# EAGLE design Robot Brushless Driver v4.3 (EAGLE 4.16)
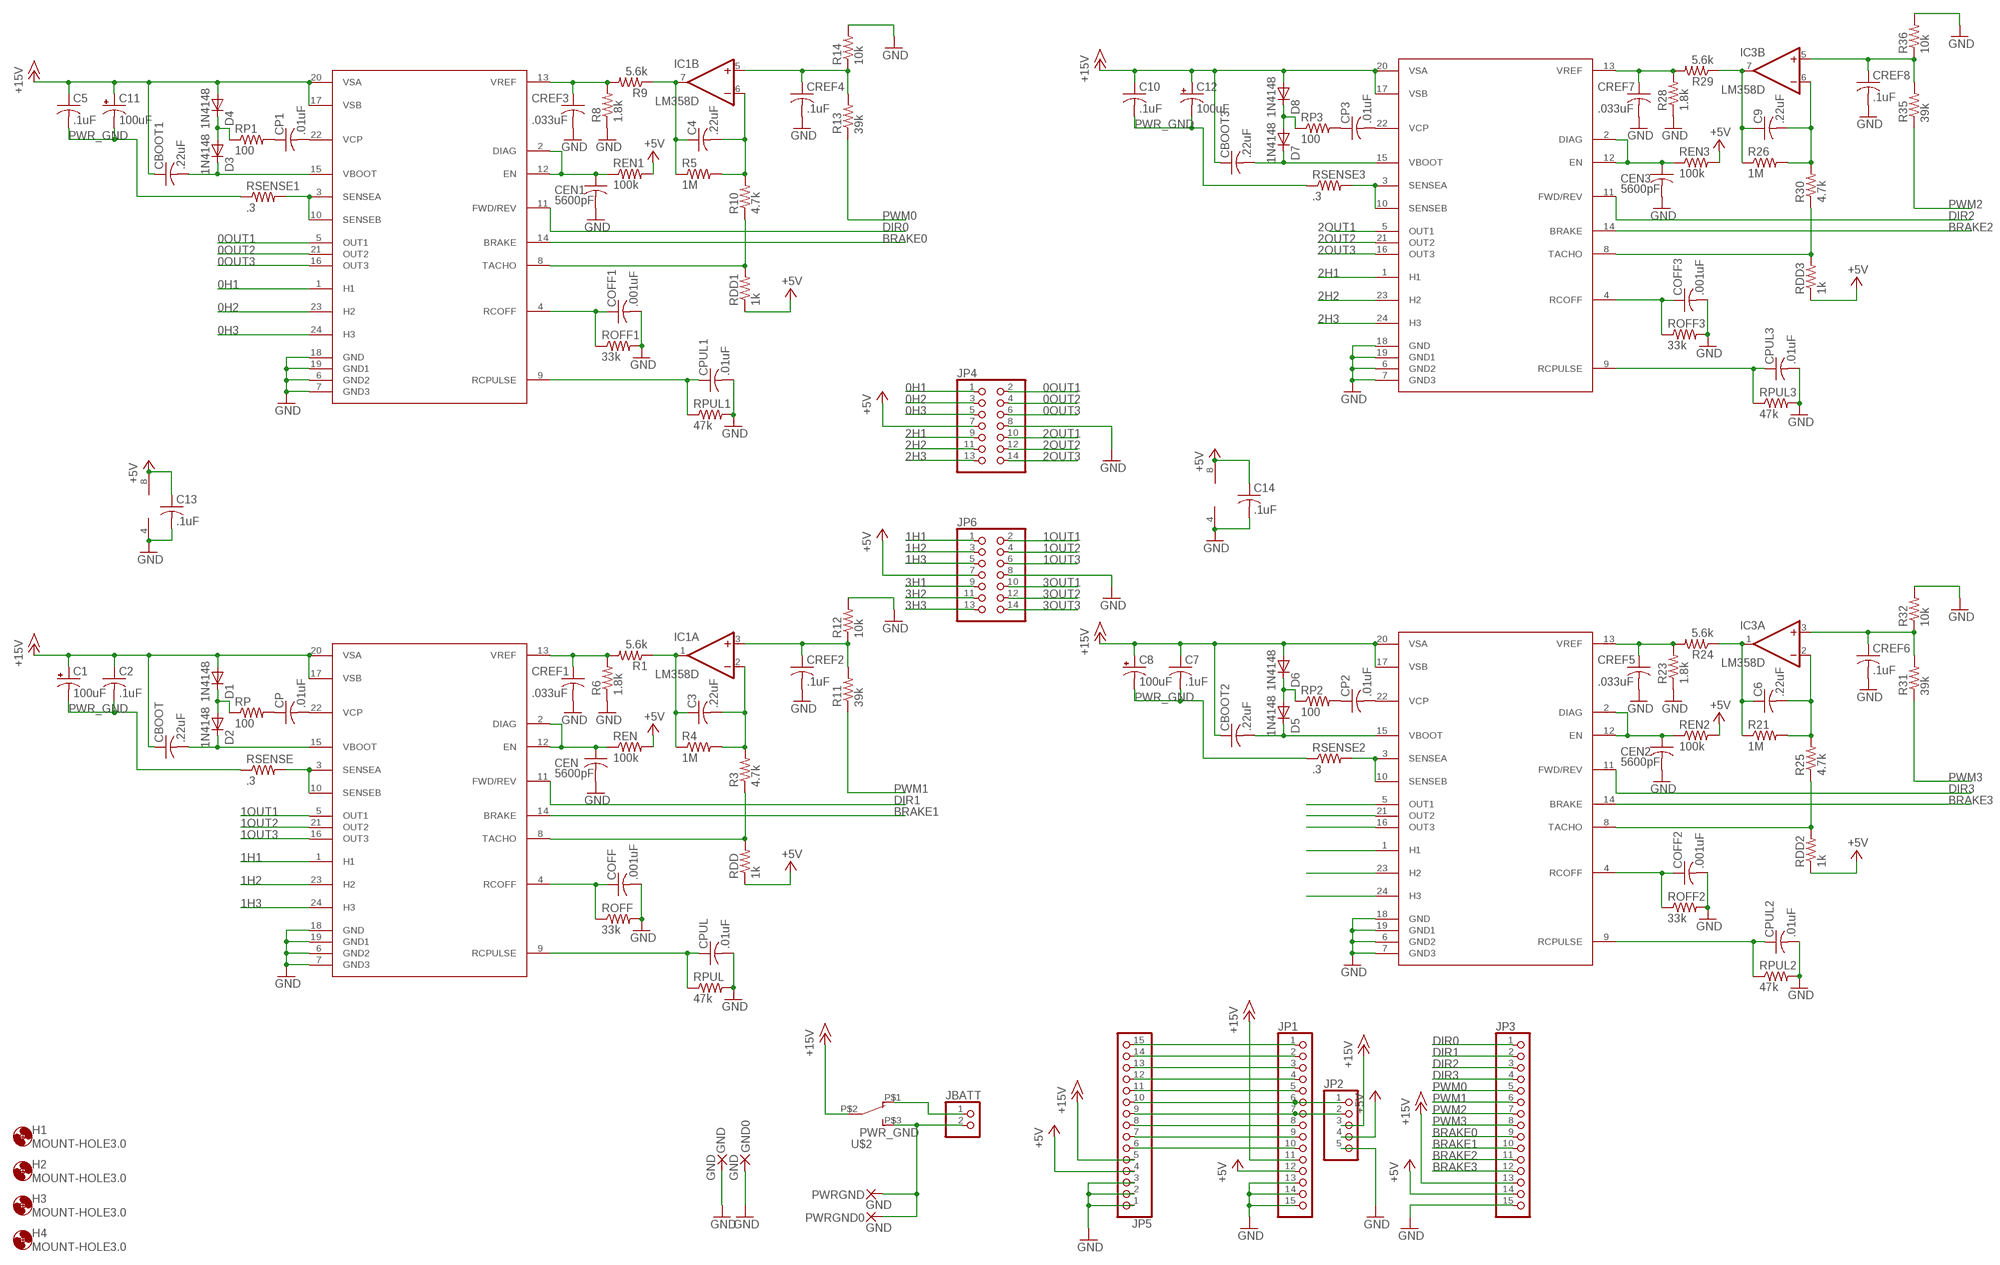
[diagram p0: schematic, sheet 1]

## Parts
C1  100uF  CPOL-USE3.5-8  [E3,5-8]
C2  .1uF  C-USC1206  [C1206]
C3  .22uF  C-USC1206  [C1206]
C4  .22uF  C-USC1206  [C1206]
C5  .1uF  C-USC1206  [C1206]
C6  .22uF  C-USC1206  [C1206]
C7  .1uF  C-USC1206  [C1206]
C8  100uF  CPOL-USE3.5-8  [E3,5-8]
C9  .22uF  C-USC1206  [C1206]
C10  .1uF  C-USC1206  [C1206]
C11  100uF  CPOL-USE3.5-8  [E3,5-8]
C12  100uF  CPOL-USE3.5-8  [E3,5-8]
C13  .1uF  C-USC1206  [C1206]
C14  .1uF  C-USC1206  [C1206]
CBOOT  .22uF  C-USC1206  [C1206]
CBOOT1  .22uF  C-USC1206  [C1206]
CBOOT2  .22uF  C-USC1206  [C1206]
CBOOT3  .22uF  C-USC1206  [C1206]
CEN  5600pF  C-USC1206  [C1206]
CEN1  5600pF  C-USC1206  [C1206]
CEN2  5600pF  C-USC1206  [C1206]
CEN3  5600pF  C-USC1206  [C1206]
COFF  .001uF  C-USC1206  [C1206]
COFF1  .001uF  C-USC1206  [C1206]
COFF2  .001uF  C-USC1206  [C1206]
COFF3  .001uF  C-USC1206  [C1206]
CP  .01uF  C-USC1206  [C1206]
CP1  .01uF  C-USC1206  [C1206]
CP2  .01uF  C-USC1206  [C1206]
CP3  .01uF  C-USC1206  [C1206]
CPUL  .01uF  C-USC1206  [C1206]
CPUL1  .01uF  C-USC1206  [C1206]
CPUL2  .01uF  C-USC1206  [C1206]
CPUL3  .01uF  C-USC1206  [C1206]
CREF1  .033uF  C-USC1206  [C1206]
CREF2  .1uF  C-USC1206  [C1206]
CREF3  .033uF  C-USC1206  [C1206]
CREF4  .1uF  C-USC1206  [C1206]
CREF5  .033uF  C-USC1206  [C1206]
CREF6  .1uF  C-USC1206  [C1206]
CREF7  .033uF  C-USC1206  [C1206]
CREF8  .1uF  C-USC1206  [C1206]
D1  1N4148  [DO35-10]
D2  1N4148  [DO35-10]
D3  1N4148  [DO35-10]
D4  1N4148  [DO35-10]
D5  1N4148  [DO35-10]
D6  1N4148  [DO35-10]
D7  1N4148  [DO35-10]
D8  1N4148  [DO35-10]
GND  GND  2,54/0,8  [2,54/0,8]
GND0  GND  2,54/0,8  [2,54/0,8]
H1  MOUNT-HOLE3.0  [3,0]
H2  MOUNT-HOLE3.0  [3,0]
H3  MOUNT-HOLE3.0  [3,0]
H4  MOUNT-HOLE3.0  [3,0]
IC1  LM358D  [SO08]
IC3  LM358D  [SO08]
JBATT  PINHD-1X2  [1X02]
JP1  PINHD-1X15  [1X15]
JP2  PINHD-1X5  [1X05]
JP3  PINHD-1X15  [1X15]
JP4  PINHD-2X7  [2X07]
JP5  PINHD-1X15  [1X15]
JP6  PINHD-2X7  [2X07]
PWRGND  GND  2,54/0,8  [2,54/0,8]
PWRGND0  GND  2,54/0,8  [2,54/0,8]
R1  5.6k  R-US_M1206  [M1206]
R3  4.7k  R-US_M1206  [M1206]
R4  1M  R-US_M1206  [M1206]
R5  1M  R-US_M1206  [M1206]
R6  1.8k  R-US_M1206  [M1206]
R8  1.8k  R-US_M1206  [M1206]
R9  5.6k  R-US_M1206  [M1206]
R10  4.7k  R-US_M1206  [M1206]
R11  39k  R-US_M1206  [M1206]
R12  10k  R-US_M1206  [M1206]
R13  39k  R-US_M1206  [M1206]
R14  10k  R-US_M1206  [M1206]
R21  1M  R-US_M1206  [M1206]
R23  1.8k  R-US_M1206  [M1206]
R24  5.6k  R-US_M1206  [M1206]
R25  4.7k  R-US_M1206  [M1206]
R26  1M  R-US_M1206  [M1206]
R28  1.8k  R-US_M1206  [M1206]
R29  5.6k  R-US_M1206  [M1206]
R30  4.7k  R-US_M1206  [M1206]
R31  39k  R-US_M1206  [M1206]
R32  10k  R-US_M1206  [M1206]
R35  39k  R-US_M1206  [M1206]
R36  10k  R-US_M1206  [M1206]
RDD  1k  R-US_M1206  [M1206]
RDD1  1k  R-US_M1206  [M1206]
RDD2  1k  R-US_M1206  [M1206]
RDD3  1k  R-US_M1206  [M1206]
REN  100k  R-US_M1206  [M1206]
REN1  100k  R-US_M1206  [M1206]
REN2  100k  R-US_M1206  [M1206]
REN3  100k  R-US_M1206  [M1206]
ROFF  33k  R-US_M1206  [M1206]
ROFF1  33k  R-US_M1206  [M1206]
ROFF2  33k  R-US_M1206  [M1206]
ROFF3  33k  R-US_M1206  [M1206]
RP  100  R-US_R1206  [R1206]
RP1  100  R-US_M1206  [M1206]
RP2  100  R-US_R1206  [R1206]
RP3  100  R-US_M1206  [M1206]
RPUL  47k  R-US_M1206  [M1206]
RPUL1  47k  R-US_M1206  [M1206]
RPUL2  47k  R-US_M1206  [M1206]
RPUL3  47k  R-US_M1206  [M1206]
RSENSE  .3  R-US_M1206  [M1206]
RSENSE1  .3  R-US_M1206  [M1206]
RSENSE2  .3  R-US_M1206  [M1206]
RSENSE3  .3  R-US_M1206  [M1206]
U$1  L6235  [SO24W]
U$2  SLIDESWITCH  [SLIDESWITCH]
U$3  L6235  [SO24W]
U$4  L6235  [SO24W]
U$7  L6235  [SO24W]

## Nets
0H1: JP4.1 U$4.1(H1)
0H2: JP4.3 U$4.23(H2)
0H3: JP4.5 U$4.24(H3)
0OUT1 [motor]: JP4.2 U$4.5(OUT1)
0OUT2 [motor]: JP4.4 U$4.21(OUT2)
0OUT3 [motor]: JP4.6 U$4.16(OUT3)
1H1: JP6.1 U$1.1(H1)
1H2: JP6.3 U$1.23(H2)
1H3: JP6.5 U$1.24(H3)
1OUT1 [motor]: JP6.2 U$1.5(OUT1)
1OUT2 [motor]: JP6.4 U$1.21(OUT2)
1OUT3 [motor]: JP6.6 U$1.16(OUT3)
2H1: JP4.9 U$7.1(H1)
2H2: JP4.11 U$7.23(H2)
2H3: JP4.13 U$7.24(H3)
2OUT1 [motor]: JP4.10 U$7.5(OUT1)
2OUT2 [motor]: JP4.12 U$7.21(OUT2)
2OUT3 [motor]: JP4.14 U$7.16(OUT3)
3H1: JP6.9 U$3.1(H1)
3H2: JP6.11 U$3.23(H2)
3H3: JP6.13 U$3.24(H3)
3OUT1 [motor]: JP6.10 U$3.5(OUT1)
3OUT2 [motor]: JP6.12 U$3.21(OUT2)
3OUT3 [motor]: JP6.14 U$3.16(OUT3)
+5V [supply]: C13.1 C14.1 IC1.8(P:V+) IC3.8(P:V+) JP1.12 JP2.4 JP3.14 JP4.7 JP5.4 JP6.7 RDD1.1 RDD2.1 RDD3.1 RDD.1 REN1.2 REN2.2 REN3.2 REN.2
+15V [supply]: C1.+ C2.1 C5.1 C7.1 C8.+ C10.1 C11.+ C12.+ CBOOT1.1 CBOOT2.1 CBOOT3.1 CBOOT.1 D1.A D4.A D6.A D8.A JP1.11 JP2.3 JP3.13 JP5.5 U$1.17(VSB) U$1.20(VSA) U$2.P$2(P) U$3.17(VSB) U$3.20(VSA) U$4.17(VSB) U$4.20(VSA) U$7.17(VSB) U$7.20(VSA)
BRAKE0: JP3.9 U$4.14(BRAKE)
BRAKE1: JP3.10 U$1.14(BRAKE)
BRAKE2: JP3.11 U$7.14(BRAKE)
BRAKE3: JP3.12 U$3.14(BRAKE)
D1: CBOOT.2 D2.C U$1.15(VBOOT)
D2: CBOOT1.2 D3.C U$4.15(VBOOT)
D3: CBOOT2.2 D5.C U$3.15(VBOOT)
D4: CBOOT3.2 D7.C U$7.15(VBOOT)
DIR0: JP3.1 U$4.11(FWD/REV)
DIR1: JP3.2 U$1.11(FWD/REV)
DIR2: JP3.3 U$7.11(FWD/REV)
DIR3: JP3.4 U$3.11(FWD/REV)
GND [supply]: C13.2 C14.2 CEN1.2 CEN2.2 CEN3.2 CEN.2 COFF1.2 COFF2.2 COFF3.2 COFF.2 CPUL1.2 CPUL2.2 CPUL3.2 CPUL.2 CREF1.2 CREF2.2 CREF3.2 CREF4.2 CREF5.2 CREF6.2 CREF7.2 CREF8.2 GND0.1(P) GND.1(P) IC1.4(P:V-) IC3.4(P:V-) JP1.13 JP1.14 JP1.15 JP2.5 JP3.15 JP4.8 JP5.1 JP5.2 JP5.3 JP6.8 R6.1 R8.1 R12.2 R14.2 R23.1 R28.1 R32.2 R36.2 ROFF1.2 ROFF2.2 ROFF3.2 ROFF.2 RPUL1.2 RPUL2.2 RPUL3.2 RPUL.2 U$1.6(GND2) U$1.7(GND3) U$1.18(GND) U$1.19(GND1) U$3.6(GND2) U$3.7(GND3) U$3.18(GND) U$3.19(GND1) U$4.6(GND2) U$4.7(GND3) U$4.18(GND) U$4.19(GND1) U$7.6(GND2) U$7.7(GND3) U$7.18(GND) U$7.19(GND1)
N$1: CPUL.1 RPUL.1 U$1.9(RCPULSE)
N$2: JP1.4 JP5.12
N$3: R3.1 RDD.2 U$1.8(TACHO)
N$4: CEN.1 REN.1 U$1.2(DIAG) U$1.12(EN)
N$5 [supply]: RSENSE.2 U$1.3(SENSEA) U$1.10(SENSEB)
N$6: JP1.5 JP5.11
N$7: JP1.3 JP5.13
N$8: COFF.1 ROFF.1 U$1.4(RCOFF)
N$9: C3.1 IC1.1(A:OUT) R1.1 R4.1
N$10: JP1.10 JP5.6
N$11: C3.2 IC1.2(A:-IN) R3.2 R4.2
N$12: D1.C D2.A RP.1
N$13: CREF2.1 IC1.3(A:+IN) R11.2 R12.1
N$18: CP.1 RP.2
N$19: CP.2 U$1.22(VCP)
N$20: CREF1.1 R1.2 R6.2 U$1.13(VREF)
N$21 [supply]: JBATT.1 U$2.P$1(O)
N$22: C4.1 IC1.7(B:OUT) R5.1 R9.1
N$23: JP1.1 JP5.15
N$27: CP1.1 RP1.2
N$28: CP1.2 U$4.22(VCP)
N$29: C6.1 IC3.1(A:OUT) R21.1 R24.1
N$30: R10.1 RDD1.2 U$4.8(TACHO)
N$34: JP1.2 JP5.14
N$35: CEN1.1 REN1.1 U$4.2(DIAG) U$4.12(EN)
N$36: C4.2 IC1.6(B:-IN) R5.2 R10.2
N$37: COFF1.1 ROFF1.1 U$4.4(RCOFF)
N$38: CPUL1.1 RPUL1.1 U$4.9(RCPULSE)
N$39: CREF3.1 R8.2 R9.2 U$4.13(VREF)
N$40: D3.A D4.C RP1.1
N$41 [supply]: RSENSE1.2 U$4.3(SENSEA) U$4.10(SENSEB)
N$42: JP1.6 JP2.1 JP5.10
N$43: CREF4.1 IC1.5(B:+IN) R13.2 R14.1
N$44: JP1.7 JP2.2 JP5.9
N$45: JP1.8 JP5.8
N$47: JP1.9 JP5.7
N$50: CP2.1 RP2.2
N$51: CP2.2 U$3.22(VCP)
N$52: R25.1 RDD2.2 U$3.8(TACHO)
N$57: CEN2.1 REN2.1 U$3.2(DIAG) U$3.12(EN)
N$58: C6.2 IC3.2(A:-IN) R21.2 R25.2
N$59: COFF2.1 ROFF2.1 U$3.4(RCOFF)
N$60: CPUL2.1 RPUL2.1 U$3.9(RCPULSE)
N$61: CREF5.1 R23.2 R24.2 U$3.13(VREF)
N$62: D5.A D6.C RP2.1
N$63 [supply]: RSENSE2.2 U$3.3(SENSEA) U$3.10(SENSEB)
N$64: C9.1 IC3.7(B:OUT) R26.1 R29.1
N$68: CP3.1 RP3.2
N$69: CP3.2 U$7.22(VCP)
N$70: R30.1 RDD3.2 U$7.8(TACHO)
N$75: CEN3.1 REN3.1 U$7.2(DIAG) U$7.12(EN)
N$76: C9.2 IC3.6(B:-IN) R26.2 R30.2
N$77: COFF3.1 ROFF3.1 U$7.4(RCOFF)
N$78: CPUL3.1 RPUL3.1 U$7.9(RCPULSE)
N$79: CREF7.1 R28.2 R29.2 U$7.13(VREF)
N$80: D7.A D8.C RP3.1
N$81 [supply]: RSENSE3.2 U$7.3(SENSEA) U$7.10(SENSEB)
N$83: CREF6.1 IC3.3(A:+IN) R31.2 R32.1
N$86: CREF8.1 IC3.5(B:+IN) R35.2 R36.1
PWM0: JP3.5 R13.1
PWM1: JP3.6 R11.1
PWM2: JP3.7 R35.1
PWM3: JP3.8 R31.1
PWR_GND [supply]: C1.- C2.2 C5.2 C7.2 C8.- C10.2 C11.- C12.- JBATT.2 PWRGND0.1(P) PWRGND.1(P) RSENSE1.1 RSENSE2.1 RSENSE3.1 RSENSE.1 U$2.P$3(S)

## Library data of the parts
C1 C8 C11 C12 = rcl:CPOL-US: POLARIZED CAPACITOR, American symbol
C2-C7 C9 C10 C13 C14 CBOOT CBOOT1-CBOOT3 CEN CEN1-CEN3 COFF COFF1-COFF3 CP CP1-CP3 CPUL CPUL1-CPUL3 CREF1-CREF8 = rcl:C-US: CAPACITOR, American symbol
D1-D8 = diode:1N4148: DIODE high speed (Philips)
GND GND0 PWRGND PWRGND0 = wirepad:2,54/0,8: THROUGH-HOLE PAD
H1-H4 = holes:MOUNT-HOLE: MOUNTING HOLE with drill center marker
IC1 IC3 = linear:LM358: OP AMP
JBATT = pinhead:PINHD-1X2: PIN HEADER
JP1 JP3 JP5 = pinhead:PINHD-1X15: PIN HEADER
JP2 = pinhead:PINHD-1X5: PIN HEADER
JP4 JP6 = pinhead:PINHD-2X7: PIN HEADER
R1 R3-R6 R8-R14 R21 R23-R26 R28-R32 R35 R36 RDD RDD1-RDD3 REN REN1-REN3 ROFF ROFF1-ROFF3 RP RP1-RP3 RPUL RPUL1-RPUL3 RSENSE RSENSE1-RSENSE3 = rcl:R-US_: RESISTOR, American symbol
U$1 U$3 U$4 U$7 = st-microelectronics:L6235
U$2 = RFClib:SLIDESWITCH

## Net classes
1 supply: width 0.508 mm
2 motor: width 0.254 mm

## Board
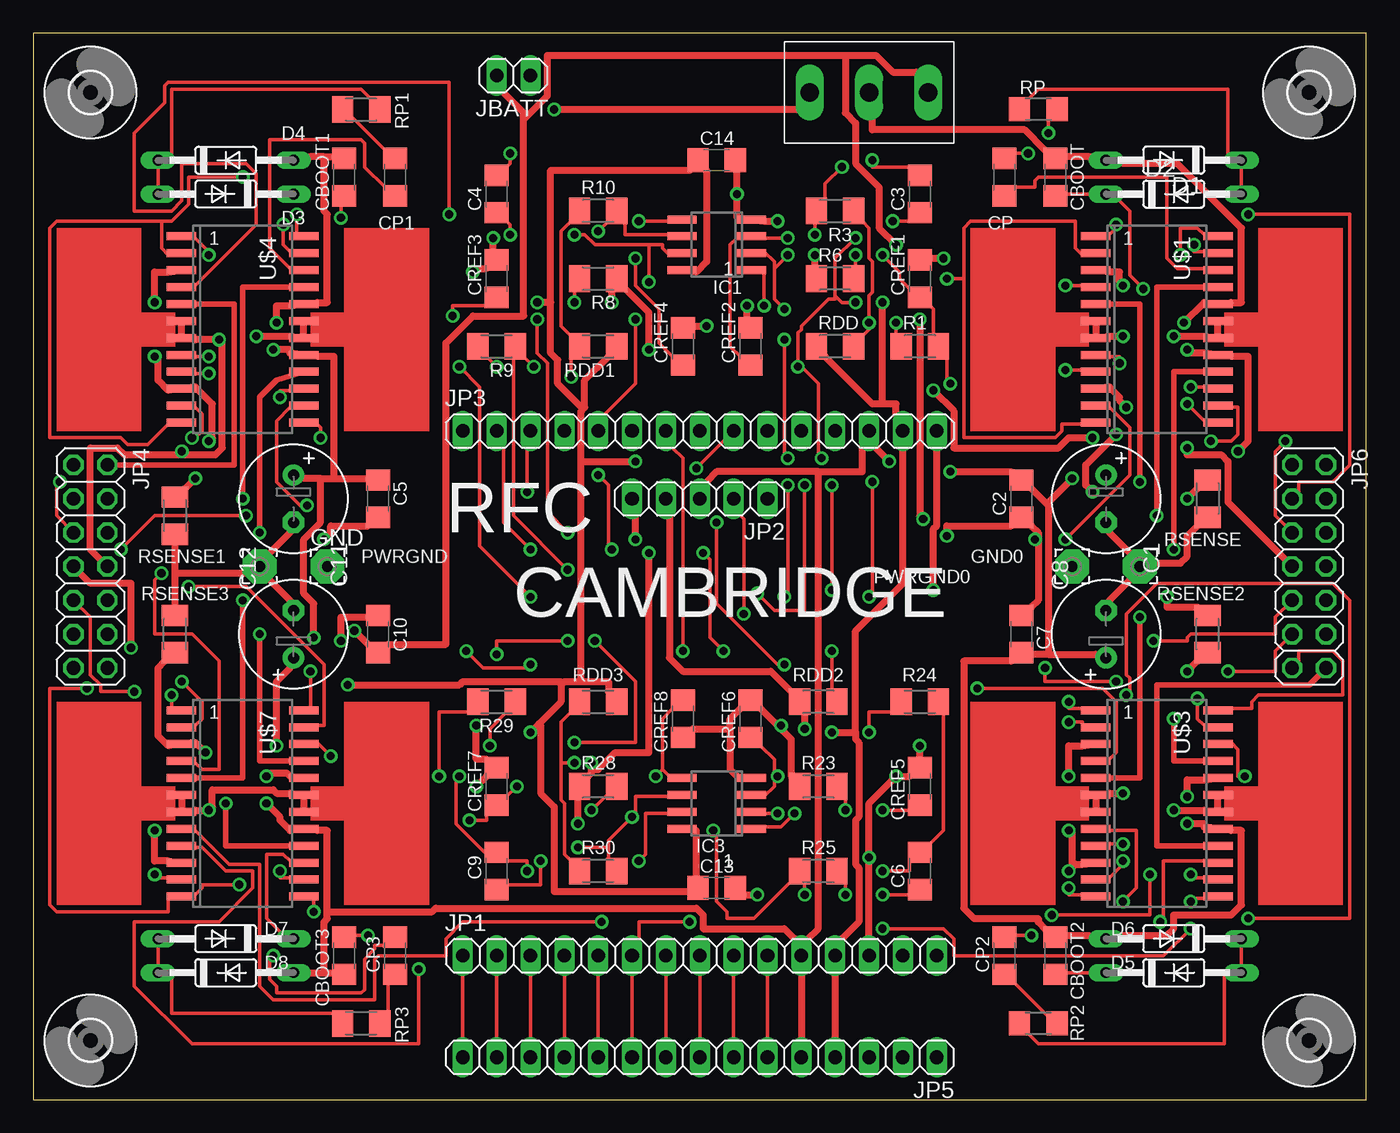
[diagram p1: board, top side]
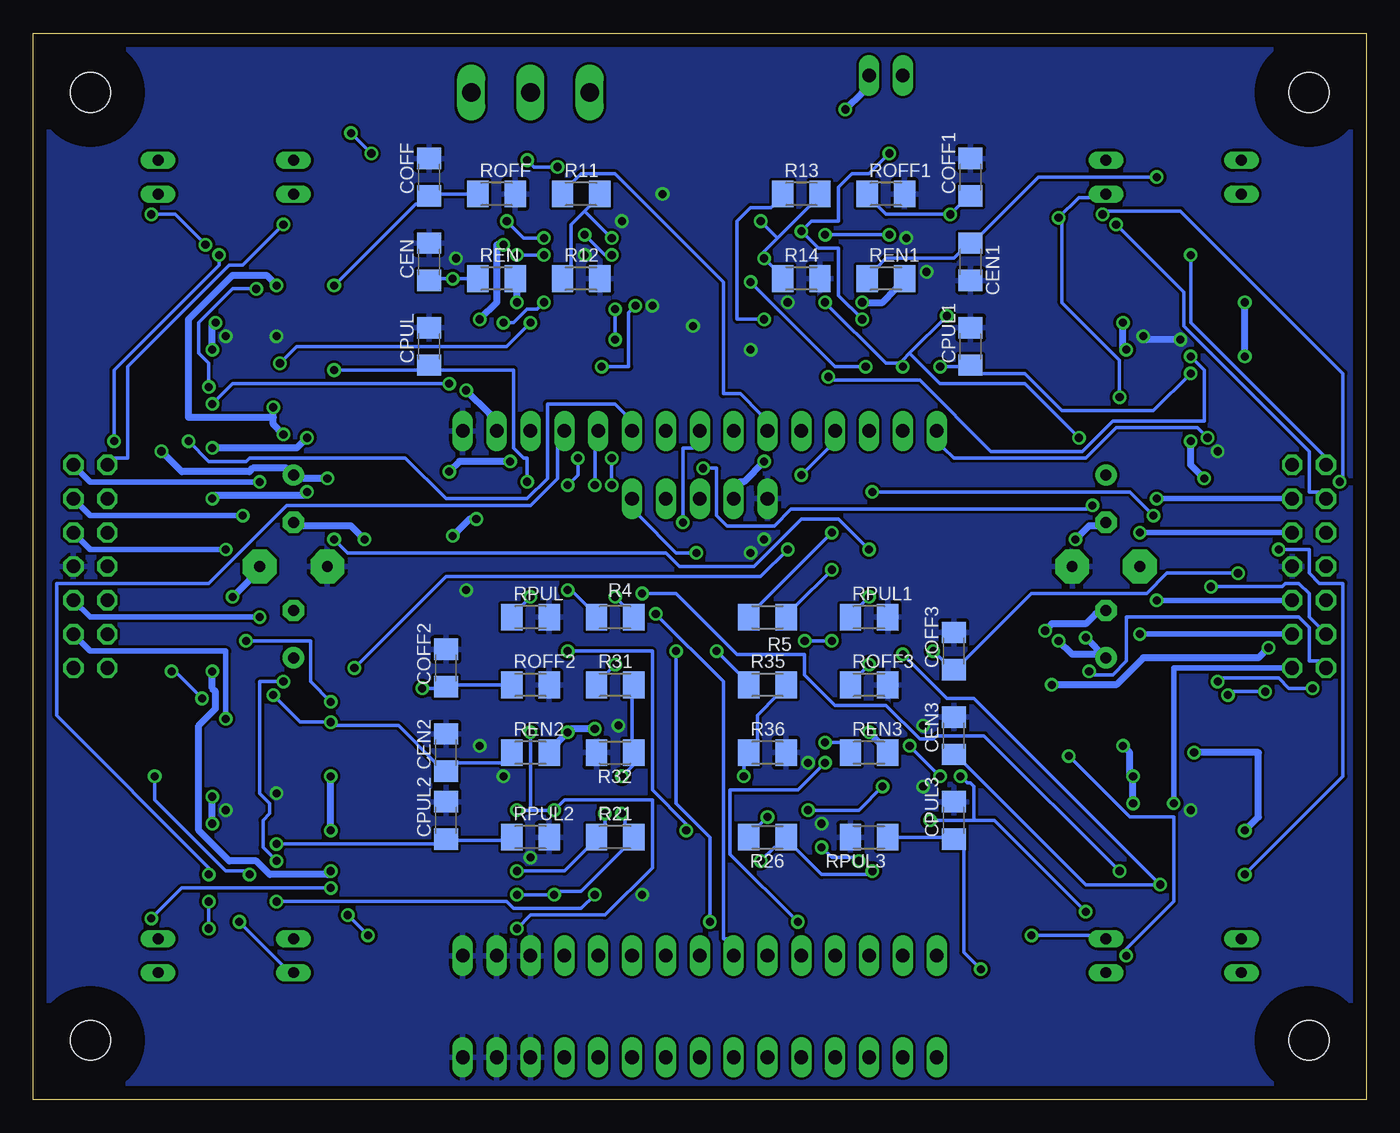
[diagram p2: board, bottom side, seen from below]

Size 100 x 80 mm. Coordinates in mm from the lower left corner, seen from the top.
Outline: 0,0 100,0 100,80 0,80 0,0
Copper layers (1*16): Top 0.035mm / dielectric 1.5mm / Bottom 0.035mm
Design rules "default": minimum track width 10mil, minimum drill 24mil, track to track 8mil, track to pad 10mil, pad to pad 8mil, via to via 8mil, smd to smd 8mil, copper to edge 40mil, drill to drill 8mil, minimum pad ring 10mil, minimum via ring 8mil, stop-mask expansion 4mil, vias tented up to drill 0mil, thermal gap 10mil

### Footprints (pad centres in the part's own frame; a part is rotated, then mirrored left to right if it is on the bottom)
E3,5-8 = drill 0.813 pad 1.6 round: + -1.778,0 | drill 0.813 pad 1.6 octagon: - 1.778,0
C1206 = smd 1.6 x 1.8: 1 -1.4,0; 2 1.4,0
DO35-10 = drill 0.813 long: A 5.08,0; C -5.08,0
2,54/0,8 = drill 0.813 pad 2.54 octagon: 1 0,0
3,0 = hole 3: 0,0
SO08 = smd 0.6 x 2.2: 1 -1.905,-2.6; 2 -0.635,-2.6; 3 0.635,-2.6; 4 1.905,-2.6; 5 1.905,2.6; 6 0.635,2.6; 7 -0.635,2.6; 8 -1.905,2.6
1X02 = drill 1.016 long: 1 -1.27,0; 2 1.27,0
1X15 = drill 1.016 long: 1 -17.78,0; 2 -15.24,0; 3 -12.7,0; 4 -10.16,0; 5 -7.62,0; 6 -5.08,0; 7 -2.54,0; 8 0,0; 9 2.54,0; 10 5.08,0; 11 7.62,0; 12 10.16,0; 13 12.7,0; 14 15.24,0; 15 17.78,0
1X05 = drill 1.016 long: 1 -5.08,0; 2 -2.54,0; 3 0,0; 4 2.54,0; 5 5.08,0
2X07 = drill 1.016 octagon: 1 -7.62,-1.27; 2 -7.62,1.27; 3 -5.08,-1.27; 4 -5.08,1.27; 5 -2.54,-1.27; 6 -2.54,1.27; 7 0,-1.27; 8 0,1.27; 9 2.54,-1.27; 10 2.54,1.27; 11 5.08,-1.27; 12 5.08,1.27; 13 7.62,-1.27; 14 7.62,1.27
M1206 = smd 1.6 x 2: 1 -1.4,0; 2 1.4,0
R1206 = smd 1.6 x 1.803: 1 -1.422,0; 2 1.422,0
SO24W = smd 0.6 x 2.2: 1 -6.985,-4.6; 2 -5.715,-4.6; 3 -4.445,-4.6; 4 -3.175,-4.6; 5 -1.905,-4.6; 6 -0.635,-4.6; 7 0.635,-4.6; 8 1.905,-4.6; 9 3.175,-4.6; 10 4.445,-4.6; 11 5.715,-4.6; 12 6.985,-4.6; 13 6.985,4.6; 14 5.715,4.6; 15 4.445,4.6; 16 3.175,4.6; 17 1.905,4.6; 18 0.635,4.6; 19 -0.635,4.6; 20 -1.905,4.6; 21 -3.175,4.6; 22 -4.445,4.6; 23 -5.715,4.6; 24 -6.985,4.6
SLIDESWITCH = drill 1.4 long: P$1 3.81,10.795; P$2 3.81,6.35; P$3 3.81,1.905

### Placement (x,y rotation side)
C1  80.48,45.08 270 top
C2  74.13,45.08 270 top
C3  66.51,67.94 90 top
C4  34.76,67.94 90 top
C5  25.87,45.08 270 top
C6  66.51,17.14 270 top
C7  74.13,34.92 90 top
C8  80.48,34.92 90 top
C9  34.76,17.14 270 top
C10  25.87,34.92 270 top
C11  19.52,45.08 270 top
C12  19.52,34.92 90 top
C13  51.27,15.87 0 top
C14  51.27,70.48 0 top
CBOOT  76.67,69.21 270 top
CBOOT1  23.33,69.21 270 top
CBOOT2  76.67,10.79 270 top
CBOOT3  23.33,10.79 90 top
CEN  70.32,62.86 90 bottom
CEN1  29.68,62.86 270 bottom
CEN2  69.05,26.03 90 bottom
CEN3  30.95,27.3 90 bottom
COFF  70.32,69.21 90 bottom
COFF1  29.68,69.21 90 bottom
COFF2  69.05,32.38 90 bottom
COFF3  30.95,33.65 90 bottom
CP  72.86,69.21 270 top
CP1  27.14,69.21 270 top
CP2  72.86,10.79 90 top
CP3  27.14,10.79 90 top
CPUL  70.32,56.51 90 bottom
CPUL1  29.68,56.51 90 bottom
CPUL2  69.05,20.95 90 bottom
CPUL3  30.95,20.95 90 bottom
CREF1  66.51,61.59 90 top
CREF2  53.81,56.51 90 top
CREF3  34.76,61.59 90 top
CREF4  48.73,56.51 90 top
CREF5  66.51,23.49 90 top
CREF6  53.81,28.57 90 top
CREF7  34.76,23.49 90 top
CREF8  48.73,28.57 270 top
D1  85.56,70.48 180 top
D2  85.56,67.94 0 top
D3  14.44,67.94 180 top
D4  14.44,70.48 0 top
D5  85.56,9.52 0 top
D6  85.56,12.06 180 top
D7  14.44,12.06 180 top
D8  14.44,9.52 0 top
GND  22.06,40 0 top
GND0  77.94,40 0 top
H1  4.28,4.44 0 top
H2  95.72,4.44 0 top
H3  4.28,75.56 0 top
H4  95.72,75.56 0 top
IC1  51.27,64.13 90 top
IC3  51.27,22.22 90 top
JBATT  36.03,76.83 180 top
JP1  50,10.79 0 top
JP2  50,45.08 180 top
JP3  50,50.16 0 top
JP4  4.28,40 270 top
JP5  50,3.17 180 top
JP6  95.72,40 270 top
PWRGND  16.98,40 0 top
PWRGND0  83.02,40 0 top
R1  66.51,56.51 0 top
R3  60.16,66.67 180 top
R4  56.35,36.19 0 bottom
R5  44.92,36.19 180 bottom
R6  60.16,61.59 0 top
R8  42.38,61.59 180 top
R9  34.76,56.51 180 top
R10  42.38,66.67 0 top
R11  58.89,67.94 0 bottom
R12  58.89,61.59 0 bottom
R13  42.38,67.94 0 bottom
R14  42.38,61.59 0 bottom
R21  56.35,19.68 0 bottom
R23  58.89,23.49 0 top
R24  66.51,29.84 180 top
R25  58.89,17.14 0 top
R26  44.92,19.68 180 bottom
R28  42.38,23.49 0 top
R29  34.76,29.84 180 top
R30  42.38,17.14 0 top
R31  56.35,31.11 0 bottom
R32  56.35,26.03 180 bottom
R35  44.92,31.11 0 bottom
R36  44.92,26.03 0 bottom
RDD  60.16,56.51 0 top
RDD1  42.38,56.51 180 top
RDD2  58.89,29.84 0 top
RDD3  42.38,29.84 180 top
REN  65.24,61.59 0 bottom
REN1  36.03,61.59 0 bottom
REN2  62.7,26.03 0 bottom
REN3  37.3,26.03 0 bottom
ROFF  65.24,67.94 0 bottom
ROFF1  36.03,67.94 0 bottom
ROFF2  62.7,31.11 0 bottom
ROFF3  37.3,31.11 0 bottom
RP  75.4,74.29 0 top
RP1  24.6,74.29 180 top
RP2  75.4,5.71 0 top
RP3  24.6,5.71 0 top
RPUL  62.7,36.19 0 bottom
RPUL1  37.3,36.19 0 bottom
RPUL2  62.7,19.68 0 bottom
RPUL3  37.3,19.68 180 bottom
RSENSE  88.1,45.08 90 top
RSENSE1  10.63,43.81 90 top
RSENSE2  88.1,34.92 270 top
RSENSE3  10.63,34.92 270 top
U$1  84.29,57.78 270 top
U$2  69.05,71.75 90 top
U$3  84.29,22.22 270 top
U$4  15.71,57.78 270 top
U$7  15.71,22.22 270 top

### Tracks (layer width: path | path; a pad name or v marks a point on that pad's centre or on a via)
0H1  (via drill 0.61)
  Top 0.254: v13.17,63.37 13.17,63.62 12.15,64.64 U$4.1
  Bottom 0.254: v13.17,63.37 13.17,58.29 3.01,48.13 JP4.1
0H2  (via drill 0.61)
  Top 0.254: v18.76,65.65 18.76,64.13 19.27,63.62 U$4.23
  Bottom 0.254: v18.76,65.65 13.68,60.57 13.68,58.03 4.28,48.64 4.28,45.59 3.52,45.59 JP4.3
0H3  (via drill 0.61)
  Top 0.254: v19.77,66.42 19.77,64.89 U$4.24 | v1.99,46.35 1.74,46.1 1.74,43.81 JP4.5
  Bottom 0.254: v19.77,66.42 19.52,66.67 13.93,66.67 1.74,54.48 1.74,46.35 v1.99,46.35
0OUT1
  Top 0.406: U$4.5 15.08,59.69 15.08,47.62 JP4.2
0OUT2  (via drill 0.6)
  Top 0.406: U$4.21 15.71,60.96 v15.71,45.08
  Bottom 0.406: JP4.4 v15.71,45.08
0OUT3  (via drill 0.6)
  Top 0.406: U$4.16 18.25,53.97 16.98,52.7 v16.98,42.54
  Bottom 0.406: JP4.6 v16.98,42.54
1H1  (via drill 0.61)
  Top 0.254: v81.24,65.65 81.24,65.4 80.73,64.89 U$1.1
  Bottom 0.254: v81.24,65.65 84.29,62.61 85.31,62.61 92.93,54.99 92.93,48.13 93.94,48.13 JP6.1
1H2  (via drill 0.61)
  Top 0.254: v87.08,64.13 87.08,63.62 87.85,63.62 U$1.23 | v91.15,66.42 98.77,66.42 98.77,47.62 97.5,46.35 94.96,46.35 94.96,45.59 JP6.3
  Bottom 0.254: v87.08,64.13 89.37,66.42 v91.15,66.42
1H3  (via drill 0.61)
  Top 0.254: v86.07,63.37 86.07,65.4 87.34,65.4 87.85,64.89 U$1.24 | v93.94,49.4 93.18,48.64 93.18,43.81 JP6.5
  Bottom 0.254: v86.07,63.37 86.07,62.61 93.94,54.73 v93.94,49.4
1OUT1  (via drill 0.6)
  Top 0.406: U$1.5 83.02,59.69 v83.02,46.35
  Bottom 0.406: v83.02,46.35 95.72,46.35 JP6.2
1OUT2  (via drill 0.6)
  Top 0.406: U$1.21 84.29,60.96 v84.29,43.81
  Bottom 0.406: v84.29,43.81 95.72,43.81 JP6.4
1OUT3  (via drill 0.6)
  Top 0.406: U$1.16 85.56,54.61 v85.56,41.27
  Bottom 0.406: v85.56,41.27 95.72,41.27 JP6.6
2H1  (via drill 0.61)
  Top 0.254: v10.38,30.35 10.38,29.33 U$7.1 | v7.58,30.6 5.04,30.6 5.04,31.11 4.28,31.87 4.28,36.19 JP4.9
  Bottom 0.254: v10.38,30.35 10.12,30.6 v7.58,30.6
2H2  (via drill 0.61)
  Top 0.254: v11.65,38.48 15.96,38.48 21.81,32.63 21.81,28.06 21.3,28.06 U$7.23
  Bottom 0.254: v11.65,38.48 6.31,38.48 6.06,38.73 5.04,38.73 4.28,37.97 4.28,36.19 JP4.11
2H3  (via drill 0.61)
  Top 0.254: v20.79,32.13 20.79,29.33 U$7.24
  Bottom 0.254: v20.79,32.13 20.54,31.87 19.01,31.87 18,32.89 18,36.19 5.04,36.19 4.28,35.43 4.28,32.89 3.52,32.89 JP4.13
2OUT1  (via drill 0.6)
  Top 0.406: U$7.5 15.71,24.12 v15.71,37.46
  Bottom 0.406: v15.71,37.46 JP4.10
2OUT2  (via drill 0.6)
  Top 0.406: U$7.21 16.98,25.39 v16.98,34.92
  Bottom 0.406: JP4.12 v16.98,34.92
2OUT3  (via drill 0.6)
  Top 0.406: U$7.16 14.44,19.04 v14.44,22.22
  Bottom 0.406: v14.44,22.22 14.44,32.38 JP4.14
3H1  (via drill 0.61)
  Top 0.254: v77.69,29.84 77.69,29.33 78.7,29.33 U$3.1 | v84.04,34.41 86.58,34.41 86.58,34.67 86.83,34.92 93.18,34.92 93.18,36.19 JP6.9
  Bottom 0.254: v77.69,29.84 79.21,31.36 79.21,34.41 v84.04,34.41
3H2  (via drill 0.61)
  Top 0.254: v87.34,30.09 87.34,28.57 87.85,28.06 U$3.23 | v89.62,32.13 93.18,32.13 93.18,33.65 JP6.11
  Bottom 0.254: v87.34,30.09 89.37,32.13 v89.62,32.13
3H3
  Top 0.254: U$3.24 89.88,29.33 91.4,29.33 91.4,29.84 91.91,30.35 98.26,30.35 98.26,32.89 97.5,33.65 94.96,33.65 94.96,32.89 JP6.13
3OUT1  (via drill 0.6)
  Top 0.406: U$3.5 83.02,24.12 v83.02,36.19
  Bottom 0.406: v83.02,36.19 95.72,36.19 JP6.10
3OUT2  (via drill 0.6)
  Top 0.406: U$3.21 85.56,25.39 v85.56,28.57
  Bottom 0.406: v85.56,28.57 85.56,33.65 95.72,33.65 JP6.12
3OUT3
  Top 0.406: U$3.16 84.29,19.04 84.29,31.11 95.72,31.11 JP6.14
+5V  (via drill 0.61)
  Top 0.508: IC1.8 49.75,62.1 50.51,62.86 50.51,69.72 C14.1 49.24,69.72 38.82,69.72 38.82,59.81 | IC3.8 49.75,20.19 49.75,16.63 C13.1 49.24,15.62 39.08,15.62 39.08,21.97 38.06,22.98 38.06,28.06 37.94,28.19 | 37.94,28.19 39.59,29.84 39.59,31.11 39.71,31.24 | 37.94,28.19 v37.3,27.55 | 39.71,31.24 39.84,31.36 41.11,31.36 | 41.11,31.36 43.14,31.36 43.14,30.6 RDD3.1 | 41.24,51.81 41.11,51.68 41.11,47.87 | 41.24,51.81 41.36,51.94 41.36,53.97 43.14,55.75 RDD1.1 | 41.11,31.36 41.11,47.87 | 38.82,59.81 v37.81,59.81 | 38.82,59.81 38.82,56 39.33,55.49 39.33,53.72 41.24,51.81 | v7.33,33.9 7.33,38.73 4.28,38.73 JP4.7 | v23.58,31.11 31.97,31.11 32.22,31.36 39.59,31.36 39.71,31.24 | v57.87,27.81 57.87,29.08 RDD2.1 56.86,30.6 55.33,32.13 48.73,32.13 47.71,33.14 47.71,43.81 JP2.4 | JP5.4 JP1.12 60.67,12.06 61.94,13.33 61.94,17.39 61.68,17.65 61.68,20.95 61.94,21.2 61.94,26.79 61.68,27.05 61.68,27.55 | 63.72,52.19 64.73,52.19 64.73,51.43 JP3.14 65.24,38.73 61.68,35.17 61.68,27.55 | 63.72,52.19 62.95,52.19 59.4,55.75 RDD.1 | 63.72,52.19 v63.72,59.81 | v86.58,48.89 86.58,48.38 89.12,48.38 89.62,47.87 89.62,44.83 JP6.7 | v79.46,49.65 77.69,49.65 76.92,48.89 69.05,48.89 69.05,51.68 v67.53,53.21 | v59.91,27.55 61.68,27.55 | 41.11,47.87 v45.17,47.87
  Bottom 0.508: v37.3,27.55 36.54,26.79 REN3.2 | v37.81,59.81 36.28,59.81 35.27,60.83 REN1.2 | v7.33,33.9 8.09,33.14 16.73,33.14 18.76,31.11 v23.58,31.11 | v57.87,27.81 59.65,27.81 v59.91,27.55 60.67,26.79 REN2.2 | v63.72,59.81 63.72,60.83 REN.2 | v86.58,48.89 80.23,48.89 v79.46,49.65 | v67.53,53.21 65.75,51.43 JP3.14 | v45.17,47.87 46.7,46.35 46.95,46.35 JP2.4
+15V  (via drill 0.61)
  Top 0.508: v86.58,56.26 86.58,56 87.85,56 U$1.17 89.88,55.75 91.15,55.75 91.15,49.4 v90.39,48.64 | v86.32,58.29 87.85,59.81 U$1.20 89.88,59.81 90.64,59.81 90.64,65.4 85.81,70.23 81.75,70.23 D1.A 79.21,70.73 77.43,70.73 CBOOT.1 75.91,71.24 74.38,72.77 62.95,72.77 62.95,73.53 U$2.P$2 | 76.16,33.4 79.72,33.4 C8.+ | 76.16,33.4 74.89,33.4 C7.1 73.37,32.89 69.81,32.89 69.81,14.35 70.57,13.58 75.4,13.58 75.4,13.33 75.91,12.82 CBOOT2.1 77.43,12.31 79.21,12.31 D6.A 81.75,12.31 85.05,12.31 85.56,12.82 85.56,13.84 89.88,13.84 90.64,14.6 90.64,20.19 89.88,20.19 U$3.17 87.85,20.44 87.85,20.7 v86.58,20.7 | 76.03,44.7 76.16,44.57 76.16,33.4 | 76.03,44.7 74.89,45.84 C2.1 73.37,47.11 v68.8,47.11 | 76.03,44.7 v77.94,46.6 | v86.58,22.73 86.58,24 87.85,24 U$3.20 | JP1.11 JP5.5 | 58.89,47.11 62.19,47.11 62.19,48.89 JP3.13 63.21,48.89 v64.22,47.87 | 58.89,47.11 51.27,47.11 50.51,46.35 JP2.3 | 58.89,47.11 58.89,12.82 58.13,12.06 JP1.11 | 21.81,70.73 20.79,70.73 D4.A | 21.81,70.73 22.57,70.73 CBOOT1.1 | 21.81,70.73 21.81,66.67 22.06,66.42 22.06,59.81 21.3,59.81 U$4.20 19.27,59.56 18.25,59.56 v18.25,58.29 | 21.55,46.6 20.28,46.6 C11.+ | 21.55,46.6 22.57,46.6 | 22.57,46.6 25.11,46.6 C5.1 | 22.57,46.6 22.57,55.75 21.3,55.75 U$4.17 19.27,56 19.27,56.26 v18,56.26 | v23.08,34.41 23.08,36.19 25.11,36.19 C10.1 | 21.81,9.52 22.57,9.52 CBOOT3.1 | D8.A 21.81,9.52 | 22.06,14.09 22.06,13.58 21.81,13.33 21.81,9.52 | 22.06,14.09 22.06,20.19 21.3,20.19 U$7.17 19.27,20.19 18.5,20.95 18.5,21.2 v17.49,22.22 | v17.49,24.25 17.49,24.51 19.01,24.51 19.27,24.25 U$7.20 | v18.25,26.54 18.25,31.36 19.27,32.38 C12.+
  Top 0.508: 21.55,46.6 21.55,43.3 20.28,42.03 20.28,37.97 21.04,37.21 v21.04,34.67 | 22.06,14.09 29.93,14.09 30.19,14.35 49.75,14.35 50.25,13.84 50.25,12.82 56.35,12.82 57.11,12.06 JP1.11
  Bottom 0.508: v86.58,56.26 86.58,58.29 v86.32,58.29 | v77.94,46.6 79.72,46.6 C1.+ 80.99,47.37 83.53,47.37 83.78,47.11 88.86,47.11 v90.39,48.64 | v86.58,20.7 v86.58,22.73 | v18.25,58.29 18.25,56.26 v18,56.26 | v23.08,34.41 22.06,33.4 20.28,33.4 C12.+ v21.04,34.67 | v17.49,22.22 v17.49,24.25 17.74,24.51 17.74,26.03 v18.25,26.54 | v68.8,47.11 68.03,47.87 v64.22,47.87
BRAKE0  (via drill 0.61)
  Top 0.254: v20.54,44.57 20.03,44.57 18.25,46.35 18.25,50.92 19.27,51.94 U$4.14 | v49.75,47.37 JP3.9
  Bottom 0.254: v20.54,44.57 20.79,44.32 43.14,44.32 44.41,43.05 47.97,43.05 48.73,43.81 48.73,47.37 v49.75,47.37
BRAKE1  (via drill 0.61)
  Top 0.254: v88.35,49.4 89.88,49.4 90.39,49.91 90.39,51.94 89.88,51.94 U$1.14
  Bottom 0.254: v88.35,49.4 86.83,47.87 84.04,47.87 83.78,48.13 72.1,48.13 69.05,45.08 62.95,45.08 61.43,46.6 61.43,52.19 56.35,52.19 55.59,51.43 JP3.10
BRAKE2  (via drill 0.61)
  Top 0.254: v18.5,17.14 18.5,16.63 19.27,16.63 U$7.14 | v54.32,37.97 55.59,36.7 57.87,36.7 v57.87,46.1
  Bottom 0.254: v18.5,17.14 28.66,27.3 32.22,27.3 32.47,27.05 33.49,27.05 36.03,29.59 39.84,29.59 42.13,31.87 42.13,33.4 47.21,33.4 51.78,37.97 v54.32,37.97 | v57.87,46.1 57.87,48.89 JP3.11
BRAKE3  (via drill 0.61)
  Top 0.254: v86.83,16.89 86.83,16.63 87.85,16.63 U$3.14
  Bottom 0.254: v86.83,16.89 86.83,17.39 98.26,28.82 98.26,38.73 86.83,38.73 80.99,44.57 62.7,44.57 60.67,46.6 60.67,48.89 JP3.12
D1  (via drill 0.61)
  Top 0.254: CBOOT.2 77.43,67.94 D2.C 81.5,67.43 82.26,66.67 82.26,61.84 v83.27,60.83 | v86.83,53.46 87.85,53.46 U$1.15
  Bottom 0.254: v86.83,53.46 86.83,55.24 87.59,56 87.59,58.29 85.05,60.83 v83.27,60.83
D2  (via drill 0.61)
  Top 0.254: v23.08,66.16 23.08,67.18 CBOOT1.2 | v18.5,52.7 18.5,53.21 19.27,53.21 U$4.15
  Bottom 0.254: D3.C 20.79,67.69 21.55,67.69 v23.08,66.16 22.82,65.91 22.82,59.81 18.5,55.49 v18.5,52.7
D3  (via drill 0.61)
  Top 0.254: CBOOT2.2 77.43,9.52 D5.C | v84.54,13.33 84.8,13.58 84.8,17.9 87.85,17.9 U$3.15
  Bottom 0.254: v84.54,13.33 81.24,10.03 D5.C
D4  (via drill 0.61)
  Top 0.254: v25.11,12.31 24.09,12.31 CBOOT3.2 | U$7.15 19.27,17.9 18.76,18.41 17.49,18.41 17.49,13.58 18.5,12.57 D7.C
  Bottom 0.254: v25.11,12.31 20.79,12.31 D7.C
DIR0  (via drill 0.61)
  Top 0.254: v11.9,49.65 12.15,49.65 12.66,50.16 12.66,51.43 12.15,51.94 U$4.11
  Bottom 0.254: v11.9,49.65 12.66,50.41 18.76,50.41 21.04,48.13 30.95,48.13 31.71,48.89 JP3.1
DIR1  (via drill 0.61)
  Top 0.254: v77.43,42.03 82.26,46.86 82.26,50.41 80.73,51.94 U$1.11 | v37.3,41.27 35.27,43.3 35.27,48.89 JP3.2
  Bottom 0.254: v77.43,42.03 76.42,41.02 52.54,41.02 51.52,40 45.94,40 42.38,43.56 39.59,43.56 v37.3,41.27
DIR2  (via drill 0.61)
  Top 0.254: v9.11,16.89 9.11,16.63 10.12,16.63 U$7.11 | v6.57,41.27 9.11,43.81 v15.96,43.81 | v37.05,45.59 37.05,48.89 JP3.3
  Bottom 0.254: v9.11,16.89 1.74,24.25 1.74,38.73 3.52,38.73 4.28,39.49 4.28,41.27 v6.57,41.27 | v15.96,43.81 17.74,45.59 v37.05,45.59
DIR3  (via drill 0.61)
  Top 0.254: v81.75,17.9 81.75,17.65 80.73,16.63 U$3.11 | v81.24,31.36 75.91,31.36 v75.91,32.38 | v43.4,41.27 43.14,41.52 43.14,46.1 v42.38,46.86
  Bottom 0.254: v81.75,17.9 82.77,18.92 82.77,20.95 82.26,21.46 82.26,22.22 83.02,22.98 83.02,31.36 v81.24,31.36 | v75.91,32.38 69.05,39.24 45.43,39.24 v43.4,41.27 | v42.38,46.86 40.35,48.89 JP3.4
GND  (via drill 0.61)
  Top 0.508: 52.29,27.81 49.49,27.81 CREF8.2 | 52.29,27.81 52.29,28.57 53.05,29.33 CREF6.2 54.57,29.33 55.97,27.93 | 55.97,27.93 56.86,27.05 56.86,24.25 R23.1 | 52.29,27.81 52.29,24.76 52.79,24.25 IC3.4 | U$3.19 88.86,22.73 88.86,21.71 U$3.18 87.85,21.71 v85.56,21.71 | U$3.7 79.72,21.71 79.72,22.73 U$3.6 80.73,22.98 v81.75,22.98 | v66.51,26.54 CREF5.2 65.75,24.25 v64.73,24.25 62.7,22.22 v62.7,18.16 JP1.13 | 55.97,27.93 v56.1,28.06 | U$7.18 20.28,21.71 20.28,22.73 U$7.19 19.27,22.98 18.25,22.98 18,23.24 13.42,23.24 13.42,21.97 v13.17,21.71 12.15,21.71 U$7.7 11.14,21.71 11.14,22.73 U$7.6 | 41.87,24.76 v41.87,25.27 | 41.87,24.76 41.87,24.51 41.62,24.25 R28.1 40.86,22.73 v40.86,20.7 | v33.24,23.49 34,24.25 CREF7.2 34,25.52 33.24,25.52 v33.24,28.06 | v54.32,15.36 53.3,15.36 C13.2 | U$4.19 20.28,58.29 20.28,57.27 U$4.18 19.27,57.27 v16.73,57.27 | U$4.6 11.14,58.29 11.14,57.27 U$4.7 12.15,57.02 v13.93,57.02 14.19,57.02 14.19,48.89 13.68,48.38 11.14,48.38 v11.14,48.64 10.88,48.38 6.82,48.38 6.31,48.89 4.28,48.89 4.28,41.27 JP4.8 | v43.4,59.81 43.4,60.83 R8.1 44.41,60.83 46.19,59.05 v46.19,56.26 | v50.51,58.03 49.49,58.03 CREF4.2 | v53.56,59.56 53.56,58.54 CREF2.2 | v58.64,63.37 58.64,62.35 R6.1 | C14.2 52.79,69.72 v52.79,67.94 52.79,66.16 IC1.4 54.83,65.91 v55.84,65.91 | U$1.19 88.86,58.29 88.86,57.27 U$1.18 87.85,57.27 v85.56,57.27 | U$1.6 79.72,58.29 79.72,57.27 U$1.7 80.73,57.27 v81.75,57.27 | v34.51,64.64 34.51,63.62 CREF3.2 34,62.35 32.98,62.35 v32.98,62.1 | v68.29,63.11 67.27,63.11 CREF1.2 | v45.17,42.03 45.17,43.81 JP2.5 | 41.87,24.76 42.38,24.76 43.65,26.03 46.19,26.03 v46.19,41.02
  Top 0.508: v67.53,38.22 67.53,42.79 67.78,43.05 JP3.15
  Bottom 0.508: v16.73,57.27 16.47,57.02 v13.93,57.02
  pour Bottom: -0.8,-0.64 -0.8,80.64 100.8,80.64 100.8,-0.64
N$1  (via drill 0.61)
  Top 0.254: v77.43,54.73 78.7,54.73 U$1.9 | v62.7,37.71 62.95,37.97 v62.95,46.35
  Bottom 0.254: v77.43,54.73 71.08,54.73 CPUL.1 69.56,54.73 63.97,54.73 63.97,48.89 63.21,48.13 62.95,48.13 v62.95,46.35 | v62.7,37.71 63.46,36.95 RPUL.1
N$2
  Top 0.254: JP5.12 JP1.4
N$3  (via drill 0.61)
  Top 0.254: RDD.2 62.19,57.27 62.7,57.78 v62.7,58.29 62.7,60.32 62.95,60.57 62.95,62.86 62.7,63.11 62.7,65.4 62.19,65.91 R3.1 | v81.5,55.24 81.5,55.75 80.73,55.75 U$1.8
  Bottom 0.254: v81.5,55.24 80.23,56.51 64.48,56.51 v62.7,58.29
N$4  (via drill 0.61)
  Top 0.254: 69.81,61.59 69.81,65.4 70.32,65.91 78.19,65.91 78.19,63.88 78.7,63.37 U$1.2 | 69.81,61.59 69.81,49.65 76.67,49.65 77.18,50.16 77.18,50.67 78.7,50.67 U$1.12 | 69.81,61.59 v68.54,61.59
  Bottom 0.254: CEN.1 69.56,61.59 v68.54,61.59 REN.1
N$5  (via drill 0.61)
  Top 0.508: v86.58,45.08 87.34,45.84 RSENSE.2 | v79.46,45.59 78.96,46.1 78.96,47.62 v81.24,49.91 | v82,51.94 81.5,52.45 81.5,52.7 80.73,53.46 U$1.10 | v81.75,61.08 81.5,61.34 81.5,62.1 80.73,62.1 U$1.3
  Bottom 0.508: v86.58,45.08 86.32,45.33 79.72,45.33 v79.46,45.59 | v81.24,49.91 82,50.67 82,51.18 | 82,51.18 v82,51.94 | v81.75,61.08 82.51,61.84 85.05,61.84 88.35,58.54 88.35,51.18 82,51.18
N$6
  Top 0.254: JP5.11 JP1.5
N$7
  Top 0.254: JP5.13 JP1.3
N$8  (via drill 0.61)
  Top 0.254: v77.43,61.08 78.7,61.08 U$1.4
  Bottom 0.254: ROFF.1 69.56,67.94 COFF.1 71.08,67.18 71.34,67.18 v77.43,61.08
N$9  (via drill 0.61)
  Top 0.254: v64.48,65.91 65.75,65.91 C3.1 | v61.68,64.64 60.16,63.11 60.16,60.32 | 60.16,60.32 60.67,59.81 v61.68,59.81 | v64.73,58.29 64.73,57.27 R1.1 | v59.91,38.22 v59.91,46.1 | v59.14,48.13 58.89,48.38 58.89,53.72 57.37,55.24 | 57.37,55.24 57.37,57.53 57.62,57.78 57.62,58.03 59.65,60.07 60.16,60.07 60.16,60.32 | v54.83,59.56 54.83,62.1 IC1.1 | 57.37,55.24 v57.37,54.99
  Bottom 0.254: v64.48,65.91 63.21,64.64 v61.68,64.64 | v61.68,59.81 62.19,59.3 62.95,59.3 63.97,58.29 v64.73,58.29 | v59.91,38.22 59.65,38.22 58.38,36.95 R4.1 | v59.91,46.1 59.14,46.86 v59.14,48.13 | v54.83,59.56 55.33,59.05 55.33,54.99 v57.37,54.99
N$10
  Top 0.254: JP5.6 JP1.10
N$11  (via drill 0.61)
  Top 0.254: v62.95,70.48 62.95,69.97 65.75,69.97 C3.2 | v60.67,69.97 59.4,68.7 59.4,67.43 R3.2 58.64,65.91 v58.64,64.89 | v56.35,37.71 56.6,37.97 v56.6,46.1 | v56.6,48.13 56.35,48.38 v56.35,57.02 | v56.35,59.3 55.59,60.07 55.59,62.35 | 55.59,62.35 55.59,62.86 54.83,63.62 IC1.2 | 55.59,62.35 v56.6,63.37
  Bottom 0.254: v62.95,70.48 62.45,69.97 v60.67,69.97 | v56.35,37.71 55.59,36.95 R4.2 | v56.6,46.1 v56.6,48.13 | v56.35,57.02 v56.35,59.3 | v58.64,64.89 57.11,63.37 v56.6,63.37
N$12
  Top 0.254: RP.1 74.64,75.05 75.4,75.81 89.62,75.81 89.62,70.99 D1.C D2.A
N$13  (via drill 0.61)
  Top 0.254: CREF2.1 53.05,55.75 52.29,56.51 52.29,64.13 52.79,64.64 IC1.3 54.83,64.64 v56.6,64.64
  Bottom 0.254: 58.64,66.67 59.65,65.65 59.65,62.35 R12.1 | 58.64,66.67 58.13,67.18 R11.2 | v56.6,64.64 58.64,66.67
N$18  (via drill 0.61)
  Top 0.254: v74.64,70.99 73.62,70.99 CP.1 | v76.16,72.51 76.16,73.53 RP.2
  Bottom 0.254: v74.64,70.99 v76.16,72.51
N$19
  Top 0.254: CP.2 73.62,68.45 75.15,68.45 75.15,68.96 75.4,69.21 85.05,69.21 85.05,63.11 85.81,62.35 87.85,62.35 U$1.22
N$20  (via drill 0.61)
  Top 0.254: v61.68,63.37 61.68,62.35 R6.2 | v63.72,63.37 64.99,62.1 64.99,61.59 65.75,60.83 CREF1.1 67.27,59.56 67.53,59.3 67.53,57.27 R1.2 68.54,55.75 68.54,53.97 v68.8,53.72 | v86.58,52.19 87.85,50.92 U$1.13
  Bottom 0.254: v63.72,63.37 v61.68,63.37 | v86.58,52.19 85.05,53.72 v68.8,53.72
N$21  (via drill 0.61)
  Top 0.508: v39.08,74.29 57.37,74.29 U$2.P$1
  Bottom 0.508: v39.08,74.29 37.81,75.56 JBATT.1
N$22  (via drill 0.61)
  Top 0.254: v35.78,64.89 35.78,65.65 35.52,65.91 C4.1 | v40.6,64.89 41.36,64.89 42.13,64.13 46.19,64.13 | 46.19,64.13 47.21,64.13 47.21,63.88 47.71,63.37 IC1.7 | v40.09,39.75 36.03,43.81 36.03,55.75 R9.1 36.79,55.75 v37.55,54.99 | v46.19,61.34 46.19,64.13
  Bottom 0.254: v40.6,64.89 v35.78,64.89 | v40.09,39.75 42.89,36.95 R5.1 | v46.19,61.34 39.84,54.99 v37.55,54.99
N$23
  Top 0.254: JP5.15 JP1.1
N$27
  Top 0.254: CP1.1 26.38,71.24 23.84,73.78 RP1.2
N$28
  Top 0.254: CP1.2 26.38,68.45 24.85,69.97 24.85,71.75 24.6,72 17.74,72 17.74,63.88 19.27,62.35 U$4.22
N$29  (via drill 0.61)
  Top 0.254: v57.11,21.46 56.1,20.44 54.83,20.44 IC3.1 | R24.1 68.29,29.08 68.29,20.19 67.27,19.17 C6.1 65.75,17.9 65.75,17.14 v63.72,17.14
  Bottom 0.254: v57.11,21.46 57.11,20.44 R21.1 58.38,18.92 60.16,17.14 v63.72,17.14
N$30  (via drill 0.61)
  Top 0.254: R10.1 40.35,65.91 39.59,65.15 39.59,58.03 40.35,57.27 RDD1.2 40.35,55.75 v40.35,54.22 | v13.17,55.75 12.15,55.75 U$4.8
  Bottom 0.254: v13.17,55.75 12.15,54.73 12.15,50.92 19.01,50.92 21.3,48.64 28.16,48.64 33.49,53.97 40.09,53.97 v40.35,54.22
N$34
  Top 0.254: JP5.14 JP1.2
N$35  (via drill 0.61)
  Top 0.254: 9.61,65.91 1.74,65.91 1.23,65.4 1.23,49.65 6.57,49.65 7.07,49.14 8.6,49.14 10.12,50.67 U$4.12 | 9.61,65.91 9.61,63.88 10.12,63.37 U$4.2 | v15.71,69.21 11.65,69.21 11.65,67.18 10.38,65.91 9.61,65.91
  Bottom 0.254: REN1.1 36.79,62.35 36.03,63.11 30.95,63.11 30.44,63.62 CEN1.1 28.92,64.89 24.6,69.21 v15.71,69.21
N$36  (via drill 0.61)
  Top 0.254: v35.78,70.99 35.78,70.23 35.52,69.97 C4.2 | v42.38,65.15 43.14,65.91 R10.2 44.41,65.91 44.41,64.89 47.71,64.89 IC1.6 | v40.09,42.54 38.57,44.06 38.57,55.24 37.81,56 v37.81,58.54
  Bottom 0.254: v35.78,70.99 37.3,69.46 38.57,69.46 39.59,68.45 39.59,65.91 41.62,65.91 v42.38,65.15 41.11,63.88 39.59,63.88 39.59,60.32 v37.81,58.54 | v40.09,42.54 45.68,36.95 R5.2
N$37  (via drill 0.61)
  Top 0.254: v31.2,66.42 31.2,76.32 10.12,76.32 9.87,76.07 9.87,74.8 7.58,72.51 7.58,66.67 10.38,66.67 11.14,67.43 11.14,70.23 15.96,70.23 16.73,69.46 16.73,65.65 12.15,61.08 U$4.4
  Bottom 0.254: COFF1.1 30.44,67.18 v31.2,66.42 36.03,66.42 36.79,67.18 ROFF1.1
N$38  (via drill 0.61)
  Top 0.254: v31.97,54.99 33.49,53.46 33.49,41.52 v37.3,37.71 | v13.17,54.48 12.15,54.48 U$4.9
  Bottom 0.254: v31.97,54.99 30.44,54.99 CPUL1.1 28.92,54.48 25.62,54.48 22.82,51.68 15.96,51.68 v13.17,54.48 | v37.3,37.71 38.06,36.95 RPUL1.1
N$39  (via drill 0.61)
  Top 0.254: v31.46,58.8 31.46,59.56 34,59.56 CREF3.1 | v34.76,54.99 34,55.75 R9.2 | v40.6,59.81 40.6,60.83 R8.2 | v21.55,49.65 21.55,50.41 21.3,50.67 U$4.13
  Bottom 0.254: 34.25,56 34.76,55.49 v34.76,54.99 35.01,55.24 36.03,55.24 v40.6,59.81 | 34.25,56 v31.46,58.8 | v21.55,49.65 25.62,53.72 31.97,53.72 34.25,56
N$40
  Top 0.254: RP1.1 25.36,75.05 24.6,75.81 10.38,75.81 10.38,70.99 D4.C D3.A
N$41  (via drill 0.61)
  Top 0.508: v12.15,46.6 11.39,45.84 RSENSE1.2 | v13.17,49.4 13.42,49.65 13.42,52.19 12.15,53.46 U$4.10 10.12,53.21 9.36,53.97 9.36,55.49 v9.11,55.75 | v9.11,59.81 9.11,62.1 10.12,62.1 U$4.3
  Bottom 0.508: v12.15,46.6 13.17,47.62 v13.17,49.4 | v9.11,55.75 v9.11,59.81
N$42  (via drill 0.61)
  Top 0.254: JP5.10 JP1.6 45.43,12.06 45.43,13.33 v49.24,13.33 | v50.25,41.02 50.76,40.51 50.76,34.67 v51.78,33.65
  Bottom 0.254: v50.25,41.02 51.78,41.02 54.57,43.81 JP2.1 | v51.78,33.65 51.78,22.22 49.24,19.68 v49.24,13.33
N$43  (via drill 0.61)
  Top 0.254: v45.17,63.11 45.17,61.08 46.95,59.3 46.95,56.76 47.97,55.75 CREF4.1 | v45.43,65.91 47.71,65.91 IC1.5
  Bottom 0.254: R14.1 44.41,62.35 v45.17,63.11 45.43,63.37 44.16,64.64 | 44.16,64.64 41.62,67.18 R13.2 | 44.16,64.64 v45.43,65.91
N$44  (via drill 0.61)
  Top 0.254: JP5.9 JP1.7 | v53.3,36.44 53.3,43.56 53.05,43.81 JP2.2
  Bottom 0.254: v53.3,36.44 48.22,31.36 48.22,12.06 47.97,12.06 JP1.7
N$45
  Top 0.254: JP5.8 JP1.8
N$47
  Top 0.254: JP5.7 JP1.9
N$50
  Top 0.254: CP2.1 73.62,8.76 76.16,6.22 RP2.2
N$51  (via drill 0.61)
  Top 0.254: v74.89,12.31 73.62,12.31 CP2.2 | v76.42,13.84 83.78,13.84 v83.78,16.89 | v90.89,24.25 90.39,24.25 90.39,26.28 89.88,26.79 U$3.22
  Bottom 0.254: v74.89,12.31 v76.42,13.84 | v83.78,16.89 84.04,17.14 85.56,17.14 90.89,22.47 v90.89,24.25
N$52  (via drill 0.61)
  Top 0.254: v51.02,20.19 51.27,19.93 51.27,14.85 52.03,14.09 52.03,13.58 54.06,13.58 56.86,16.38 R25.1 57.87,16.38 v57.87,15.36 | v59.91,33.65 59.91,30.6 RDD2.2 | v81.75,14.85 82.77,15.87 82.77,20.19 80.73,20.19 U$3.8
  Bottom 0.254: v51.02,20.19 51.02,20.7 53.56,23.24 53.56,33.65 v59.91,33.65 | v81.75,14.85 64.48,14.85 63.97,14.35 58.89,14.35 v57.87,15.36
N$57  (via drill 0.61)
  Top 0.254: v77.69,15.87 77.69,15.36 78.7,15.36 U$3.12 | v91.15,13.58 98.77,13.58 98.77,37.46 97.5,38.73 84.29,38.73 82,36.44 82,31.87 82.26,31.62 82.26,30.6 v82,30.35 | v77.69,28.32 78.7,28.32 78.7,28.06 U$3.2
  Bottom 0.254: REN2.1 64.73,25.27 68.29,25.27 CEN2.1 69.81,25.27 72.61,28.06 77.43,28.06 v77.69,28.32 79.97,28.32 v82,30.35 | v77.69,15.87 88.86,15.87 v91.15,13.58
N$58  (via drill 0.61)
  Top 0.254: v55.84,21.46 54.83,21.46 IC3.2 | v63.72,15.36 65.75,15.36 C6.2 | v60.92,15.36 60.92,16.38 R25.2
  Bottom 0.254: v55.84,21.46 55.59,21.46 55.59,20.44 R21.2 55.59,18.92 58.89,15.62 60.67,15.62 v60.92,15.36 v63.72,15.36
N$59  (via drill 0.61)
  Top 0.254: v70.83,30.86 80.23,30.86 81.24,29.84 81.24,26.03 80.73,25.52 U$3.4
  Bottom 0.254: ROFF2.1 68.29,31.11 COFF2.1 69.81,30.86 v70.83,30.86
N$60  (via drill 0.61)
  Top 0.254: v81.75,19.17 80.73,19.17 U$3.9
  Bottom 0.254: RPUL2.1 64.73,19.43 68.29,19.43 CPUL2.1 69.81,19.17 v81.75,19.17
N$61  (via drill 0.61)
  Top 0.254: v63.72,21.71 65.75,21.71 CREF5.1 | v60.92,21.71 60.92,22.73 R23.2 | v62.7,27.55 62.7,29.08 64.48,29.08 R24.2 | v86.83,14.85 86.83,15.11 87.85,15.11 U$3.13 | v86.83,12.82 84.8,10.79 69.05,10.79 69.05,12.06 68.29,12.82 v63.72,12.82
  Bottom 0.254: 62.7,21.71 v60.92,21.71 60.16,22.47 53.56,22.47 53.56,17.39 57.11,13.84 62.7,13.84 v63.72,12.82 | 62.7,21.71 v63.72,21.71 | 62.7,21.71 v62.7,27.55 | v86.83,12.82 v86.83,14.85
N$62
  Top 0.254: RP2.1 74.64,4.95 75.4,4.19 89.37,4.19 89.37,9.27 D5.A D6.C
N$63  (via drill 0.61)
  Top 0.508: v86.58,32.13 87.34,32.89 RSENSE2.2 | 78.07,17.52 78.19,17.65 78.7,17.65 U$3.10 | v77.69,17.14 78.07,17.52 | v77.69,24.25 77.69,26.54 78.7,26.54 U$3.3 | v77.69,20.19 77.94,19.93 77.94,17.65 78.07,17.52
  Bottom 0.508: v86.58,32.13 86.58,30.86 86.32,30.6 86.32,29.33 87.59,28.06 87.59,20.19 85.31,17.9 83.27,17.9 82.26,16.89 77.94,16.89 v77.69,17.14 | v77.69,20.19 v77.69,24.25
N$64  (via drill 0.61)
  Top 0.254: v37.05,17.14 37.05,17.9 35.52,17.9 C9.1 34,18.41 31.71,20.7 31.71,24 v31.97,24.25 | v34.25,26.54 34.25,27.81 35.52,29.08 R29.1 | v45.43,17.9 45.94,18.41 45.94,21.46 47.71,21.46 IC3.7
  Bottom 0.254: v37.05,17.14 37.3,16.89 40.86,16.89 42.89,18.92 R26.1 44.16,18.92 44.41,18.92 v45.43,17.9 | v31.97,24.25 v34.25,26.54
N$68
  Top 0.254: CP3.1 26.63,8.76 26.63,6.47 RP3.2
N$69  (via drill 0.61)
  Top 0.254: v18,10.79 17.74,10.54 17.74,9.01 18.25,8.5 18.25,8 24.6,8 24.85,8.25 24.85,10.54 25.62,11.3 25.62,11.55 26.38,11.55 CP3.2 | v22.31,25.78 21.3,26.79 U$7.22
  Bottom 0.254: v18,10.79 18,11.3 14.44,14.85 14.44,21.2 17.74,21.2 v22.31,25.78
N$70  (via drill 0.61)
  Top 0.254: 39.59,25.27 39.59,28.32 40.35,29.08 RDD3.2 | 39.59,25.27 39.59,22.47 39.84,22.22 39.84,18.41 40.35,17.9 R30.1 | v42.63,13.33 32.22,13.33 30.95,12.06 30.95,10.79 25.87,10.79 25.62,10.54 25.62,7.49 18,7.49 16.98,8.5 16.98,17.65 14.69,17.65 12.15,20.19 U$7.8 | v40.6,25.27 39.59,25.27
  Bottom 0.254: v42.63,13.33 47.71,18.41 47.71,23.24 42.63,23.24 v40.6,25.27
N$75  (via drill 0.61)
  Top 0.254: v15.46,16.12 12.66,16.12 12.66,15.87 12.15,15.36 U$7.12 10.12,15.11 10.12,14.09 1.74,14.09 1.23,14.6 1.23,30.86 v4.03,30.86 | v40.6,26.79 45.17,26.79 45.17,31.36 v42.13,34.41 | v40.09,34.41 34.76,34.41 v34.76,33.4 | v11.14,31.36 12.66,29.84 12.66,28.57 12.15,28.06 U$7.2
  Bottom 0.254: CEN3.1 30.19,25.27 21.04,16.12 v15.46,16.12 29.43,30.09 31.46,30.09 v34.76,33.4 | v40.6,26.79 39.33,26.79 REN3.1 | v40.09,34.41 v42.13,34.41 | v11.14,31.36 10.88,31.62 6.57,31.62 5.8,30.86 v4.03,30.86
N$76  (via drill 0.61)
  Top 0.254: v38.06,17.9 38.06,16.12 35.52,16.12 C9.2 | v40.86,18.92 43.14,18.92 | 43.14,18.92 43.14,17.9 R30.2 | 43.14,18.92 43.14,19.43 v44.92,21.2 45.17,21.46 45.17,22.73 47.71,22.73 IC3.6
  Bottom 0.254: v38.06,17.9 38.32,18.16 40.09,18.16 v40.86,18.92 | v44.92,21.2 45.68,20.44 R26.2
N$77  (via drill 0.61)
  Top 0.254: v32.47,33.65 33.74,32.38 37.3,32.38 v37.3,32.63 | v9.61,39.49 9.11,38.98 9.11,34.92 11.9,34.92 13.93,32.89 13.93,24.76 12.66,24.76 12.15,25.27 U$7.4
  Bottom 0.254: v32.47,33.65 31.71,32.89 COFF3.1 30.19,32.89 25.11,37.97 16.47,37.97 14.95,39.49 v9.61,39.49 | v37.3,32.63 38.06,31.87 ROFF3.1
N$78  (via drill 0.61)
  Top 0.254: v28.92,9.77 28.92,4.19 11.9,4.19 7.58,8.5 7.58,13.33 13.93,13.33 16.47,15.87 16.47,17.14 14.44,17.14 12.66,18.92 12.15,18.92 U$7.9
  Bottom 0.254: RPUL3.1 31.71,19.68 CPUL3.1 30.19,18.92 30.19,11.04 v28.92,9.77
N$79  (via drill 0.61)
  Top 0.254: v36.28,23.49 35.52,22.73 CREF7.1 34,21.46 34,20.95 v32.73,20.95 | v41.87,21.71 43.14,22.98 R28.2 | v30.44,24.25 30.44,29.08 32.73,29.08 R29.2 | v21.04,14.09 21.04,15.11 U$7.13
  Bottom 0.254: v36.28,23.49 38.06,21.71 v41.87,21.71 | v30.44,24.25 29.93,23.74 29.68,23.74 29.43,23.49 29.43,20.95 | 29.43,20.95 v32.73,20.95 | v21.04,14.09 27.9,20.95 29.43,20.95
N$80
  Top 0.254: RP3.1 22.57,6.47 10.38,6.47 10.38,9.01 D8.C D7.A
N$81  (via drill 0.61)
  Top 0.508: RSENSE3.2 9.87,32.89 9.36,32.38 9.36,27.3 10.12,26.54 U$7.3 12.15,26.79 v12.92,26.03 | v9.11,20.19 9.11,17.9 10.12,17.9 U$7.10
  Bottom 0.508: v9.11,20.19 8.09,21.2 8.09,26.03 v12.92,26.03
N$83  (via drill 0.61)
  Top 0.254: 55.59,24.25 55.59,23.49 54.83,22.73 IC3.3 | 55.59,24.25 55.59,25.52 54.57,26.54 CREF6.1 | 55.59,24.25 v55.84,24.25
  Bottom 0.254: R31.2 55.08,30.35 55.08,26.79 R32.1 54.83,25.27 v55.84,24.25
N$86  (via drill 0.61)
  Top 0.254: 47.21,24.76 47.21,28.57 47.97,29.33 CREF8.1 | 47.21,24.76 47.71,24.25 IC3.5 | 47.21,24.76 v46.7,24.25
  Bottom 0.254: v46.7,24.25 46.7,25.27 R36.1 45.68,26.79 45.68,28.82 44.16,30.35 R35.2
PWM0  (via drill 0.61)
  Top 0.254: v45.17,58.54 45.17,53.72 42.89,51.43 JP3.5
  Bottom 0.254: v45.17,58.54 47.21,58.54 47.21,65.91 46.19,66.92 44.67,66.92 44.41,67.18 R13.1
PWM1
  Bottom 0.254: R11.1 59.65,68.7 58.89,69.46 56.35,69.46 48.22,61.34 48.22,52.95 46.95,52.95 45.43,51.43 JP3.6
PWM2  (via drill 0.61)
  Top 0.254: v48.73,33.65 48.73,48.13 47.97,48.89 JP3.7
  Bottom 0.254: v48.73,33.65 46.95,31.87 R35.1
PWM3  (via drill 0.61)
  Top 0.254: v56.35,32.63 55.84,32.63 51.27,37.21 v51.27,43.3
  Bottom 0.254: v56.35,32.63 57.11,31.87 R31.1 | v51.27,43.3 51.27,48.89 50.51,48.89 JP3.8
PWR_GND  (via drill 0.61)
  Top 0.508: v21.81,42.03 22.31,42.54 22.31,43.05 25.11,43.05 C5.2 | RSENSE3.1 10.63,39.49 | 10.63,39.49 RSENSE1.1 | C12.- 19.27,37.46 17.74,38.98 PWRGND.1 | 10.63,39.49 15.96,39.49 PWRGND.1 | C11.- 19.27,42.54 17.74,41.02 PWRGND.1 | 75.4,42.03 75.4,42.54 74.89,43.05 C2.2 73.37,43.05 68.54,43.05 v68.54,42.29 | 75.4,42.03 75.4,37.46 74.89,36.95 C7.2 | v85.05,37.71 85.05,36.95 87.34,36.95 RSENSE2.1 | RSENSE.1 87.34,43.05 86.58,42.29 86.58,40.76 86.07,40.25 84.04,40.25 PWRGND0.1 | C8.- 80.73,37.46 82.26,38.98 PWRGND0.1 | C1.- 80.73,42.54 82.26,41.02 PWRGND0.1 | 75.4,42.03 v75.15,42.03 | 36.79,73.53 36.79,74.04 35.27,75.56 JBATT.2 | 36.79,73.53 36.79,58.8 32.98,58.8 30.95,56.76 30.95,34.16 26.63,34.16 C10.2 25.11,34.16 v24.09,35.17 | 60.92,78.35 38.57,78.35 38.57,75.31 36.79,73.53 | 60.92,78.35 63.21,78.35 64.48,77.08 66.26,77.08 U$2.P$3 | v66.76,43.56 66.51,43.81 v66.51,58.54 | v64.73,64.13 63.46,65.4 63.46,68.45 61.68,70.23 61.68,73.27 60.92,74.04 60.92,78.35
  Bottom 0.508: v21.81,42.03 20.79,43.05 20.28,43.05 C11.- | v85.05,37.71 83.78,38.98 PWRGND0.1 | v75.15,42.03 76.16,43.05 79.72,43.05 C1.- | v68.54,42.29 67.27,43.56 v66.76,43.56 | v66.51,58.54 65.24,59.81 65.24,64.13 v64.73,64.13 | v24.09,35.17 23.58,35.68 21.04,35.68 20.28,36.44 C12.-
(copper drawn outside any net)
  shapes: Top area x16

### Text on the board
tPlace: 1 | 1 | 1 | RFC | CAMBRIDGE | 1 | 1 | 1